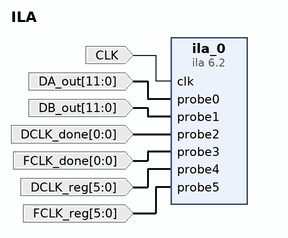
[diagram p0: block diagram of the top level]
# Vivado block design ILA, xc7k325tffg676-2, Vivado 2024.2
create_bd_design ILA

create_bd_port -dir I -type clk CLK
create_bd_port -dir I -from 11 -to 0 DA_out
create_bd_port -dir I -from 11 -to 0 DB_out
create_bd_port -dir I -from 0 -to 0 DCLK_done
create_bd_port -dir I -from 0 -to 0 FCLK_done
create_bd_port -dir I -from 5 -to 0 DCLK_reg
create_bd_port -dir I -from 5 -to 0 FCLK_reg

create_bd_cell -type ip -vlnv xilinx.com:ip:ila:6.2 ila_0
set_property -dict [list \
  CONFIG.C_DATA_DEPTH 65536 \
  CONFIG.C_ENABLE_ILA_AXI_MON false \
  CONFIG.C_MONITOR_TYPE Native \
  CONFIG.C_NUM_OF_PROBES 6 \
  CONFIG.C_PROBE0_WIDTH 12 \
  CONFIG.C_PROBE1_WIDTH 12 \
  CONFIG.C_PROBE4_WIDTH 6 \
  CONFIG.C_PROBE5_WIDTH 6 \
] [get_bd_cells ila_0]

# ---- connections ----

connect_bd_net -net clk_0_1 [get_bd_ports CLK] [get_bd_pins ila_0/clk]
connect_bd_net -net probe0_0_1 [get_bd_ports DA_out] [get_bd_pins ila_0/probe0]
connect_bd_net -net probe1_0_1 [get_bd_ports DB_out] [get_bd_pins ila_0/probe1]
connect_bd_net -net probe2_0_1 [get_bd_ports DCLK_done] [get_bd_pins ila_0/probe2]
connect_bd_net -net probe3_0_1 [get_bd_ports FCLK_done] [get_bd_pins ila_0/probe3]
connect_bd_net -net probe4_0_1 [get_bd_ports DCLK_reg] [get_bd_pins ila_0/probe4]
connect_bd_net -net probe5_0_1 [get_bd_ports FCLK_reg] [get_bd_pins ila_0/probe5]

validate_bd_design
save_bd_design
